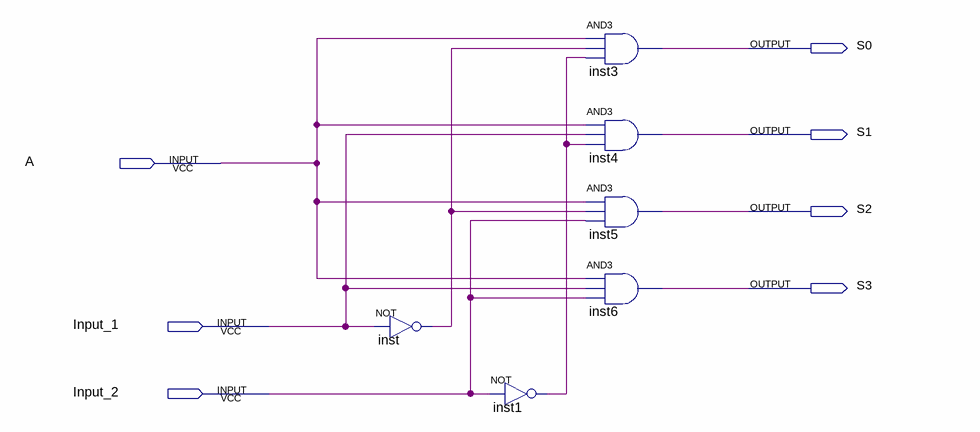
[diagram p0: schematic sheet]
// Quartus schematic demux_1x4.bdf as structural Verilog: 6 symbols, 7 pins
module demux_1x4 (
  input  A,
  input  Input_1,
  input  Input_2,
  output S0,
  output S1,
  output S2,
  output S3
);

  wire inst1_out, inst_out;

  not inst (inst_out, Input_1);
  not inst1 (inst1_out, Input_2);
  and inst3 (S0, A, inst_out, inst1_out);
  and inst4 (S1, A, Input_1, inst1_out);
  and inst5 (S2, A, inst_out, Input_2);
  and inst6 (S3, A, Input_1, Input_2);
endmodule
